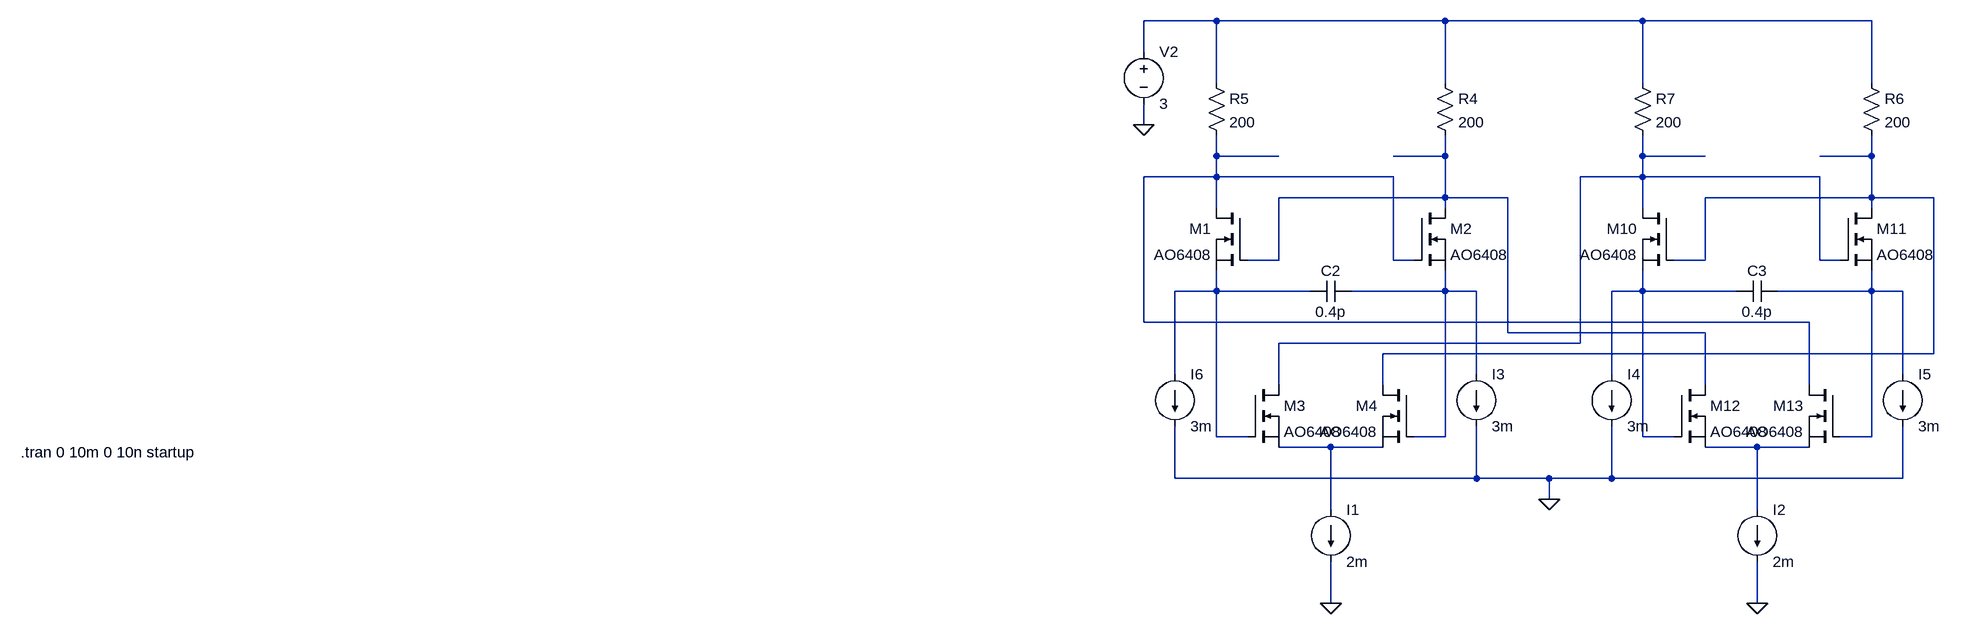
[diagram p0: schematic QPSK_Phase_Shift.asc]
QPSK_Phase_Shift.asc, the LTspice schematic file:
Version 4
SHEET 1 4200 884
WIRE 1168 -688 1056 -688
WIRE 1520 -688 1168 -688
WIRE 1824 -688 1520 -688
WIRE 2176 -688 1824 -688
WIRE 1056 -640 1056 -688
WIRE 1168 -592 1168 -688
WIRE 1520 -592 1520 -688
WIRE 1824 -592 1824 -688
WIRE 2176 -592 2176 -688
WIRE 1056 -528 1056 -560
WIRE 1168 -480 1168 -512
WIRE 1264 -480 1168 -480
WIRE 1520 -480 1520 -512
WIRE 1520 -480 1440 -480
WIRE 1824 -480 1824 -512
WIRE 1920 -480 1824 -480
WIRE 2176 -480 2176 -512
WIRE 2176 -480 2096 -480
WIRE 1168 -448 1168 -480
WIRE 1168 -448 1056 -448
WIRE 1440 -448 1168 -448
WIRE 1824 -448 1824 -480
WIRE 1824 -448 1728 -448
WIRE 2096 -448 1824 -448
WIRE 1520 -416 1520 -480
WIRE 1520 -416 1264 -416
WIRE 1616 -416 1520 -416
WIRE 2176 -416 2176 -480
WIRE 2176 -416 1920 -416
WIRE 2272 -416 2176 -416
WIRE 1168 -400 1168 -448
WIRE 1520 -400 1520 -416
WIRE 1824 -400 1824 -448
WIRE 2176 -400 2176 -416
WIRE 1264 -320 1264 -416
WIRE 1264 -320 1216 -320
WIRE 1440 -320 1440 -448
WIRE 1472 -320 1440 -320
WIRE 1920 -320 1920 -416
WIRE 1920 -320 1872 -320
WIRE 2096 -320 2096 -448
WIRE 2128 -320 2096 -320
WIRE 1168 -272 1168 -304
WIRE 1168 -272 1104 -272
WIRE 1312 -272 1168 -272
WIRE 1520 -272 1520 -304
WIRE 1520 -272 1376 -272
WIRE 1568 -272 1520 -272
WIRE 1824 -272 1824 -304
WIRE 1824 -272 1776 -272
WIRE 1968 -272 1824 -272
WIRE 2176 -272 2176 -304
WIRE 2176 -272 2032 -272
WIRE 2224 -272 2176 -272
WIRE 1056 -224 1056 -448
WIRE 2080 -224 1056 -224
WIRE 1616 -208 1616 -416
WIRE 1920 -208 1616 -208
WIRE 1728 -192 1728 -448
WIRE 1728 -192 1264 -192
WIRE 2272 -176 2272 -416
WIRE 2272 -176 1424 -176
WIRE 1104 -144 1104 -272
WIRE 1568 -144 1568 -272
WIRE 1776 -144 1776 -272
WIRE 2224 -144 2224 -272
WIRE 1264 -128 1264 -192
WIRE 1424 -128 1424 -176
WIRE 1920 -128 1920 -208
WIRE 2080 -128 2080 -224
WIRE 1168 -48 1168 -272
WIRE 1216 -48 1168 -48
WIRE 1520 -48 1520 -272
WIRE 1520 -48 1472 -48
WIRE 1824 -48 1824 -272
WIRE 1872 -48 1824 -48
WIRE 2176 -48 2176 -272
WIRE 2176 -48 2128 -48
WIRE 1344 -32 1264 -32
WIRE 1424 -32 1344 -32
WIRE 2000 -32 1920 -32
WIRE 2080 -32 2000 -32
WIRE 1104 16 1104 -64
WIRE 1568 16 1568 -64
WIRE 1568 16 1104 16
WIRE 1680 16 1568 16
WIRE 1776 16 1776 -64
WIRE 1776 16 1680 16
WIRE 2224 16 2224 -64
WIRE 2224 16 1776 16
WIRE 1680 48 1680 16
WIRE 1344 64 1344 -32
WIRE 2000 64 2000 -32
WIRE 1344 208 1344 144
WIRE 2000 208 2000 144
FLAG 1056 -528 0
FLAG 1344 208 0
FLAG 2000 208 0
FLAG 1680 48 0
SYMBOL nmos 1216 -400 M0
SYMATTR InstName M1
SYMATTR Value AO6408
SYMBOL nmos 1472 -400 R0
SYMATTR InstName M2
SYMATTR Value AO6408
SYMBOL res 1504 -608 R0
SYMATTR InstName R4
SYMATTR Value 200
SYMBOL res 1152 -608 R0
SYMATTR InstName R5
SYMATTR Value 200
SYMBOL nmos 1216 -128 R0
SYMATTR InstName M3
SYMATTR Value AO6408
SYMBOL nmos 1472 -128 M0
SYMATTR InstName M4
SYMATTR Value AO6408
SYMBOL cap 1376 -288 R90
WINDOW 0 0 32 VBottom 2
WINDOW 3 32 32 VTop 2
SYMATTR InstName C2
SYMATTR Value 0.4p
SYMBOL nmos 1872 -400 M0
SYMATTR InstName M10
SYMATTR Value AO6408
SYMBOL nmos 2128 -400 R0
SYMATTR InstName M11
SYMATTR Value AO6408
SYMBOL res 2160 -608 R0
SYMATTR InstName R6
SYMATTR Value 200
SYMBOL res 1808 -608 R0
SYMATTR InstName R7
SYMATTR Value 200
SYMBOL nmos 1872 -128 R0
SYMATTR InstName M12
SYMATTR Value AO6408
SYMBOL nmos 2128 -128 M0
SYMATTR InstName M13
SYMATTR Value AO6408
SYMBOL cap 2032 -288 R90
WINDOW 0 0 32 VBottom 2
WINDOW 3 32 32 VTop 2
SYMATTR InstName C3
SYMATTR Value 0.4p
SYMBOL voltage 1056 -656 R0
WINDOW 123 0 0 Left 0
WINDOW 39 0 0 Left 0
SYMATTR InstName V2
SYMATTR Value 3
SYMBOL current 1344 64 R0
WINDOW 123 0 0 Left 0
WINDOW 39 0 0 Left 0
SYMATTR InstName I1
SYMATTR Value 2m
SYMBOL current 2000 64 R0
WINDOW 123 0 0 Left 0
WINDOW 39 0 0 Left 0
SYMATTR InstName I2
SYMATTR Value 2m
SYMBOL current 1568 -144 R0
WINDOW 123 0 0 Left 0
WINDOW 39 0 0 Left 0
SYMATTR InstName I3
SYMATTR Value 3m
SYMBOL current 1776 -144 R0
WINDOW 123 0 0 Left 0
WINDOW 39 0 0 Left 0
SYMATTR InstName I4
SYMATTR Value 3m
SYMBOL current 2224 -144 R0
WINDOW 123 0 0 Left 0
WINDOW 39 0 0 Left 0
SYMATTR InstName I5
SYMATTR Value 3m
SYMBOL current 1104 -144 R0
WINDOW 123 0 0 Left 0
WINDOW 39 0 0 Left 0
SYMATTR InstName I6
SYMATTR Value 3m
TEXT -672 -24 Left 2 !.tran 0 10m 0 10n startup

The netlist it stands for:
* QPSK_Phase_Shift.asc
M1 N002 N003 N006 N006 AO6408
M2 N003 N002 N007 N007 AO6408
R4 N001 N003 200
R5 N001 N002 200
M3 N004 N006 N010 N010 AO6408
M4 N005 N007 N010 N010 AO6408
C2 N007 N006 0.4p
M10 N004 N005 N008 N008 AO6408
M11 N005 N004 N009 N009 AO6408
R6 N001 N005 200
R7 N001 N004 200
M12 N003 N008 N011 N011 AO6408
M13 N002 N009 N011 N011 AO6408
C3 N009 N008 0.4p
V2 N001 0 3
I1 N010 0 2m
I2 N011 0 2m
I3 N007 0 3m
I4 N008 0 3m
I5 N009 0 3m
I6 N006 0 3m
.model NMOS NMOS
.model PMOS PMOS
.lib standard.mos
.tran 0 10m 0 10n startup
.backanno
.end